# EAGLE schematic LLC (EAGLE 9.2.2)
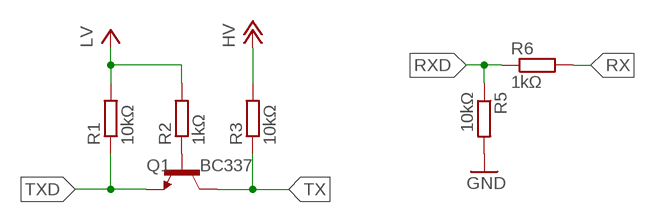
[diagram p0: schematic, sheet 1]

## Parts
Q1  BC337  [TO92-EBC]
R1  10kΩ  RCL_R-EU_0207/10  [RCL_0207/10]
R2  1kΩ  RCL_R-EU_0207/10  [RCL_0207/10]
R3  10kΩ  RCL_R-EU_0207/10  [RCL_0207/10]
R5  10kΩ  RCL_R-EU_0207/10  [RCL_0207/10]
R6  1kΩ  RCL_R-EU_0207/10  [RCL_0207/10]

## Nets
GND: R5.2
HV: R3.2
LV: R1.2 R2.2
N$1: Q1.B R2.1
RX: R6.2
RXD: R5.1 R6.1
TX: Q1.C R3.1
TXD: Q1.E R1.1

## Library data of the parts
Q1 = ITIS:BC337*: NPN Transistor
R1-R3 R5 R6 = ITIS:RCL_R-EU_: RESISTOR, European symbol